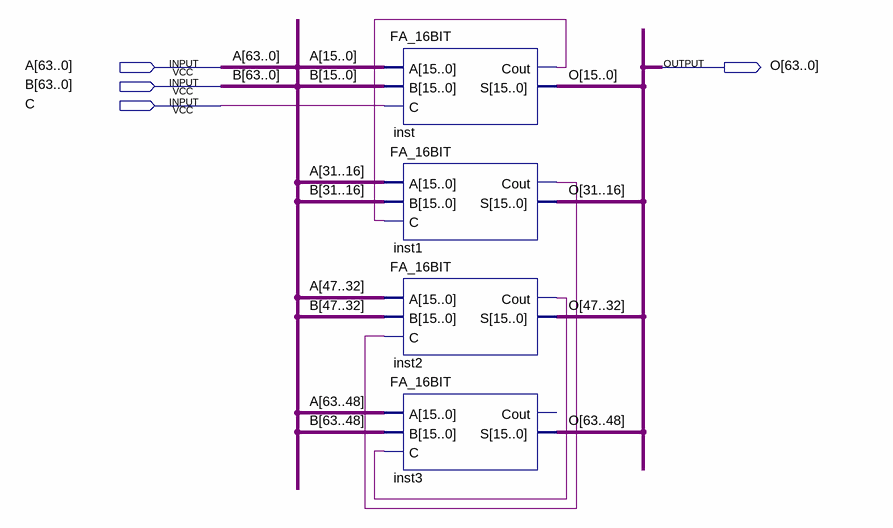
[diagram p0: schematic sheet]
// Quartus schematic FA_64bits.bdf as structural Verilog: 4 symbols, 4 pins
module FA_64bits (
  input  [63:0] A,
  input  [63:0] B,
  input  C,
  output [63:0] O
);

  wire inst1_cout, inst2_cout, inst_cout;

  FA_16BIT inst (.A(A[15:0]), .B(B[15:0]), .C(C), .Cout(inst_cout), .S(O[15:0]));
  FA_16BIT inst1 (.A(A[31:16]), .B(B[31:16]), .C(inst_cout), .Cout(inst1_cout), .S(O[31:16]));
  FA_16BIT inst2 (.A(A[47:32]), .B(B[47:32]), .C(inst1_cout), .Cout(inst2_cout), .S(O[47:32]));
  FA_16BIT inst3 (.A(A[63:48]), .B(B[63:48]), .C(inst2_cout), .S(O[63:48]));  // open: Cout
endmodule
